# EAGLE schematic SolidStateRelaySmartCharger (EAGLE 9.6.2)
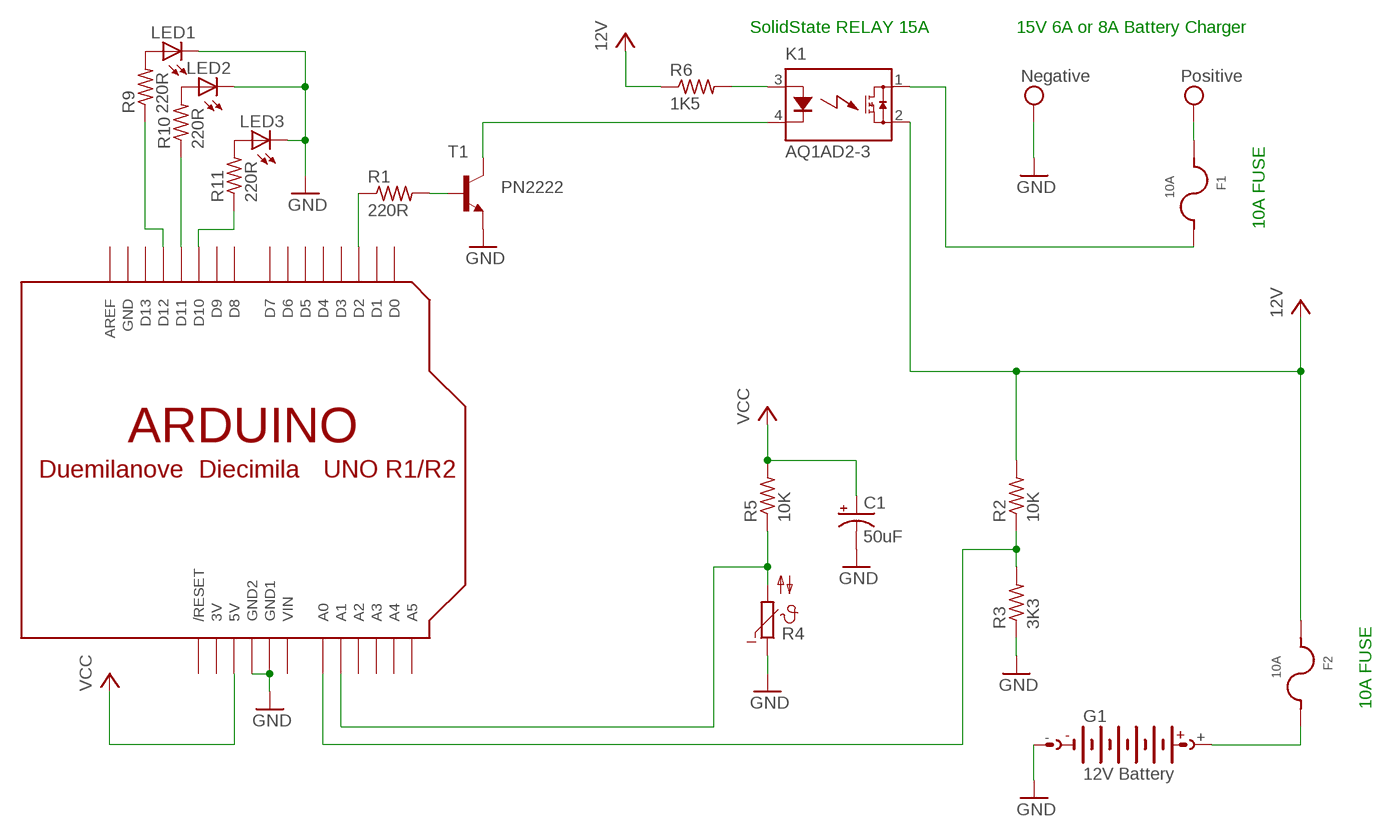
[diagram p0: schematic, sheet 1]

## Parts
C1  50uF  C-POL-US_RADIAL-11MM-DIA  [CAPPRD508W65D1000H1100B]
F1  10A  01110501Z  [01110501Z]
F2  10A  01110501Z  [01110501Z]
G1  12V Battery  AB9V  [AB9V]
K1  AQ1AD2-3  [AQ1]
LED1  LED5MM  [LED5MM]
LED2  LED5MM  [LED5MM]
LED3  LED5MM  [LED5MM]
R1  220R  R-US_0207/12  [0207/12]
R2  10K  R-US_0207/12  [0207/12]
R3  3K3  R-US_0207/12  [0207/12]
R4  NTC640  [P640]
R5  10K  R-US_0207/12  [0207/12]
R6  1K5  R-US_0207/12  [0207/12]
R9  220R  R-US_0207/12  [0207/12]
R10  220R  R-US_0207/12  [0207/12]
R11  220R  R-US_0207/12  [0207/12]
T1  PN2222  2N2222  [TO18]
U$1  ARDUINOUNO  [ARDUINO]

## Nets
GND: C1.2(-) G1.- LED1.K(C) LED2.K(C) LED3.K(C) R3.1 R4.1 T1.1(E) U$1.GND1 U$1.GND2 ; supply symbol labelled Negative
N$1: R1.2 T1.2(B)
N$2: K1.4(K) T1.3(C)
N$3: R1.1 U$1.D2
N$4: F2.2 G1.+
N$5: R2.1 R3.2 U$1.A0
N$6: R9.1 U$1.D12
N$7: F1.2 K1.1(DS1)
N$8: R4.2 R5.1 U$1.A1
N$9: R10.1 U$1.D11
N$10: K1.3(A) R6.2
N$11: R11.1 U$1.D10
N$12: LED1.A R9.2
N$13: LED2.A R10.2
N$14: LED3.A R11.2
VCC: C1.1(+) F1.1 F2.1 K1.2(DS2) R2.2 R5.2 R6.1 U$1.5V ; supply symbol labelled 12V, Positive
Unconnected: U$1.A2 U$1.A3 U$1.A4 U$1.A5 U$1.AREF U$1.D0 U$1.D1 U$1.D3 U$1.D4 U$1.D5 U$1.D6 U$1.D7 U$1.D8 U$1.D9 U$1.D13 U$1.RESET(/RESET)

## Notes on the sheet
- SolidState RELAY 15A | 15V 6A or 8A Battery Charger
- 10A FUSE
- 10A FUSE

## Power pins joined to a net without a drawn wire
3V: U$1.3V
GND: U$1.GND
VIN: U$1.VIN

## Library data of the parts
C1 = Capacitor:C-POL-US: Capacitor Polarised - ANSI; CATEGORY: Capacitor
F1 F2 = Fuse Holder:01110501Z: FUSE CLIP CARTRIDGE 250V 10A PCB Manufacturer's datasheet <https://www.littelfuse.com/~/media/electronics/datasheets/fuse_clips/littelfuse_fuse_clip_111_datasheet.pdf.pdf>; CREATED_BY: PCBLayout.com; DIGIKEY_PN: F4189-ND; MANUFACTURER: Littelfuse Inc.; MPN: 01110501Z
G1 = battery:AB9V: 9-V BATTERY CLIP
K1 = relay:AQ*: SOLID STATE RELAY NAiS Source: http://www.mew-europe.com/.. en_ds_61601_0000.pdf; MF: AROMAT/ MATSUSHITA; MPN: AQ1AD2-3/28VDC; OC_FARNELL: unknown; OC_NEWARK: 10C4052
LED1-LED3 = adafruit:LED: LED OSRAM: - CHIPLED LG R971, LG N971, LY N971, LG Q971, LY Q971, LO R971, LY R971 LH N974, LH R974 LS Q976, LO Q976, LY Q976 LO Q996 - Hyper CHIPLED LW Q18S LB Q993, LB Q99A, LB R99A - SideLED LS A670, LO A670, LY A670, LG A670, LP A670 LB A673, LV A673, LT A673, LW A673 LH A674 LY A675 LS A676, LA A676, LO A676, LY A676, LW A676 LS A679, LY A679, LG A679 - Hyper Micro SIDELED® LS Y876, LA Y876, LO Y876, LY Y876 LT Y87S - SmartLED LW L88C, LW L88S LB L89C, LB L89S, LG L890 LS L89K, LO L89K, LY L89K LS L896, LA L896, LO L896, LY L896 - TOPLED LS T670, LO T670, LY T670, LG T670, LP T670 LSG T670, LSP T670, LSY T670, LOP T670, LYG T670 LG T671, LOG T671, LSG T671 LB T673, LV T673, LT T673, LW T673 LH T674 LS T676, LA T676, LO T676, LY T676, LB T676, LH T676, LSB T676, LW T676 LB T67C, LV T67C, LT T67C, LS T67K, LO T67K, LY T67K, LW E67C LS E67B, LA E67B, LO E67B, LY E67B, LB E67C, LV E67C, LT E67C LW T67C LS T679, LY T679, LG T679 LS T770, LO T770, LY T770, LG T770, LP T770 LB T773, LV T773, LT T773, LW T773 LH T774 LS E675, LA E675, LY E675, LS T675 LS T776, LA T776, LO T776, LY T776, LB T776 LHGB T686 LT T68C, LB T68C - Hyper Mini TOPLED® LB M676 - Mini TOPLED Santana® LG M470 LS M47K, LO M47K, LY M47K Source: http://www.osram.convergy.de/
R1-R3 R5 R6 R9-R11 = adafruit:R-US_: RESISTOR, American symbol
R4 = ptc-ntc:NTC640: PHILIPS NTC; OC_FARNELL: unknown; OC_NEWARK: unknown
T1 = transistor:2N2222: NPN TRANSISTOR
U$1 = adafruit:ARDUINO: Arduino Diecimila/Duemilanove Make a shield with ease, this package has all the named pins as well as the two mounting drill holes and an outline of the USB and DC power connector. The outline is on the DIMENSION layer, so if your board house uses it they will cut the outline to match. http://www.ladyada.net/library/pcb/eaglelibrary.html